# EAGLE design main (EAGLE 9.6.2)
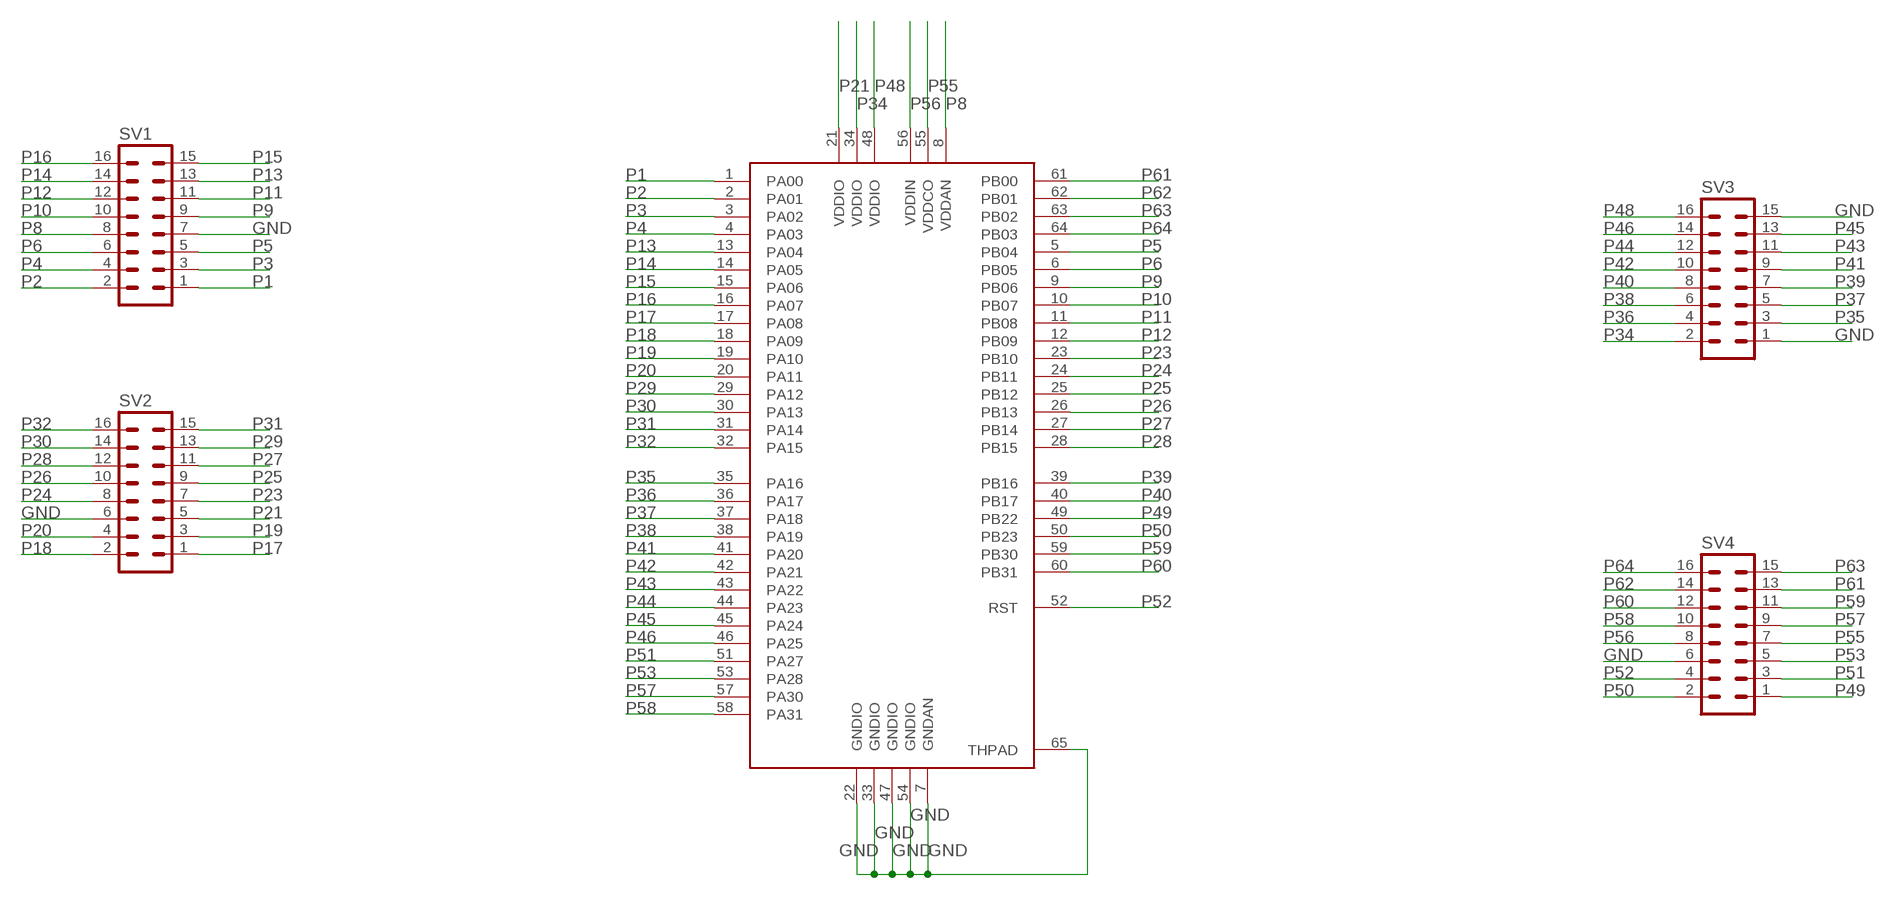
[diagram p0: schematic, sheet 1]

## Parts
SV1  MA08-2  [MA08-2]
SV2  MA08-2  [MA08-2]
SV3  MA08-2  [MA08-2]
SV4  MA08-2  [MA08-2]
U$1  ATSAMD21J18AQFN64  [QFN50P900X900X100-65T535]

## Nets
GND: SV1.7 SV2.6 SV3.1 SV3.15 SV4.6 U$1.7(GNDAN) U$1.22(GNDIO) U$1.33(GNDIO) U$1.47(GNDIO) U$1.54(GNDIO) U$1.65(THPAD)
P1: SV1.1 U$1.1(PA00)
P2: SV1.2 U$1.2(PA01)
P3: SV1.3 U$1.3(PA02)
P4: SV1.4 U$1.4(PA03)
P5: SV1.5 U$1.5(PB04)
P6: SV1.6 U$1.6(PB05)
P8: SV1.8 U$1.8(VDDAN)
P9: SV1.9 U$1.9(PB06)
P10: SV1.10 U$1.10(PB07)
P11: SV1.11 U$1.11(PB08)
P12: SV1.12 U$1.12(PB09)
P13: SV1.13 U$1.13(PA04)
P14: SV1.14 U$1.14(PA05)
P15: SV1.15 U$1.15(PA06)
P16: SV1.16 U$1.16(PA07)
P17: SV2.1 U$1.17(PA08)
P18: SV2.2 U$1.18(PA09)
P19: SV2.3 U$1.19(PA10)
P20: SV2.4 U$1.20(PA11)
P21: SV2.5 U$1.21(VDDIO)
P23: SV2.7 U$1.23(PB10)
P24: SV2.8 U$1.24(PB11)
P25: SV2.9 U$1.25(PB12)
P26: SV2.10 U$1.26(PB13)
P27: SV2.11 U$1.27(PB14)
P28: SV2.12 U$1.28(PB15)
P29: SV2.13 U$1.29(PA12)
P30: SV2.14 U$1.30(PA13)
P31: SV2.15 U$1.31(PA14)
P32: SV2.16 U$1.32(PA15)
P34: SV3.2 U$1.34(VDDIO)
P35: SV3.3 U$1.35(PA16)
P36: SV3.4 U$1.36(PA17)
P37: SV3.5 U$1.37(PA18)
P38: SV3.6 U$1.38(PA19)
P39: SV3.7 U$1.39(PB16)
P40: SV3.8 U$1.40(PB17)
P41: SV3.9 U$1.41(PA20)
P42: SV3.10 U$1.42(PA21)
P43: SV3.11 U$1.43(PA22)
P44: SV3.12 U$1.44(PA23)
P45: SV3.13 U$1.45(PA24)
P46: SV3.14 U$1.46(PA25)
P48: SV3.16 U$1.48(VDDIO)
P49: SV4.1 U$1.49(PB22)
P50: SV4.2 U$1.50(PB23)
P51: SV4.3 U$1.51(PA27)
P52: SV4.4 U$1.52(RST)
P53: SV4.5 U$1.53(PA28)
P55: SV4.7 U$1.55(VDDCO)
P56: SV4.8 U$1.56(VDDIN)
P57: SV4.9 U$1.57(PA30)
P58: SV4.10 U$1.58(PA31)
P59: SV4.11 U$1.59(PB30)
P60: SV4.12 U$1.60(PB31)
P61: SV4.13 U$1.61(PB00)
P62: SV4.14 U$1.62(PB01)
P63: SV4.15 U$1.63(PB02)
P64: SV4.16 U$1.64(PB03)

## Library data of the parts
SV1-SV4 = con-lstb_custom2:MA08-2: PIN HEADER; OC_FARNELL: unknown; OC_NEWARK: unknown
U$1 = atsamd21j18a:ATSAMD21J18A

## Board
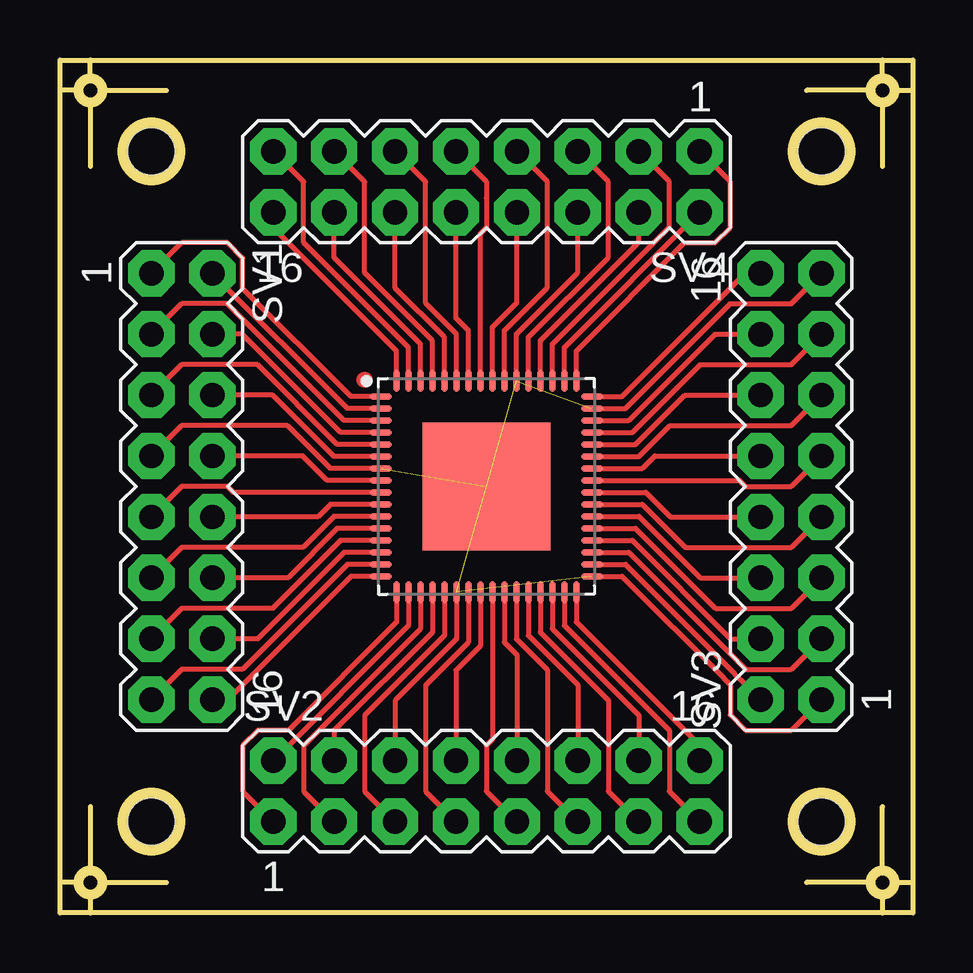
[diagram p1: board, top side]

Size 35.56 x 35.56 mm. Coordinates in mm from the lower left corner, seen from the top.
Outline: 34.29,35.56 0,35.56 0,1.27
Outline: 34.29,35.56 35.56,35.56 35.56,34.29
Outline: 35.56,34.29 35.56,1.27
Outline: 35.56,1.27 35.56,0 34.29,0
Outline: 34.29,0 1.27,0
Outline: 1.27,0 0,0 0,1.27
Outline: 1.91,1.27 4.45,1.27
Outline: 1.27,4.45 1.27,1.91
Outline: 0.64,1.27 0,1.27
Outline: 1.27,0.64 1.27,0
Outline: 34.29,0.64 34.29,0
Outline: 34.92,1.27 35.56,1.27
Outline: 34.29,1.91 34.29,4.45
Outline: 33.66,1.27 31.11,1.27
Outline: 34.92,34.29 35.56,34.29
Outline: 34.29,34.92 34.29,35.56
Outline: 33.66,34.29 31.11,34.29
Outline: 34.29,33.66 34.29,31.11
Outline: 1.27,34.92 1.27,35.56
Outline: 0.64,34.29 0,34.29
Outline: 1.91,34.29 4.45,34.29
Outline: 1.27,33.66 1.27,31.11
Outline: circle at 34.29,34.29 radius 0.5
Outline: circle at 1.27,34.29 radius 0.5
Outline: circle at 1.27,1.27 radius 0.5
Outline: circle at 34.29,1.27 radius 0.5
Outline: circle at 3.81,31.75 radius 1.2
Outline: circle at 31.75,31.75 radius 1.2
Outline: circle at 3.81,3.81 radius 1.2
Outline: circle at 31.75,3.81 radius 1.2
Copper layers (1*16): Top 0.035mm / dielectric 1.5mm / Bottom 0.035mm
Design rules "default *": minimum track width 6mil, minimum drill 0.35mm, track to track 0.25mm, track to pad 8mil, pad to pad 8mil, via to via 8mil, smd to smd 8mil, copper to edge 40mil, drill to drill 6mil, minimum pad ring 10mil, minimum via ring 8mil, stop-mask expansion 4mil, vias tented up to drill 0mil, thermal gap 10mil
Holes 2 mm at 3.81,31.75 31.75,31.75 3.81,3.81 31.75,3.81

### Footprints (pad centres in the part's own frame; a part is rotated, then mirrored left to right if it is on the bottom)
MA08-2 = drill 1.016 pad 1.93 octagon: 1 -8.89,-1.27; 2 -8.89,1.27; 3 -6.35,-1.27; 4 -6.35,1.27; 5 -3.81,-1.27; 6 -3.81,1.27; 7 -1.27,-1.27; 8 -1.27,1.27; 9 1.27,-1.27; 10 1.27,1.27; 11 3.81,-1.27; 12 3.81,1.27; 13 6.35,-1.27; 14 6.35,1.27; 15 8.89,-1.27; 16 8.89,1.27
QFN50P900X900X100-65T535 = smd 0.911 x 0.264: 1 -4.401,3.75; 2 -4.401,3.25; 3 -4.401,2.75; 4 -4.401,2.25; 5 -4.401,1.75; 6 -4.401,1.25; 7 -4.401,0.75; 8 -4.401,0.25; 9 -4.401,-0.25; 10 -4.401,-0.75; 11 -4.401,-1.25; 12 -4.401,-1.75; 13 -4.401,-2.25; 14 -4.401,-2.75; 15 -4.401,-3.25; 16 -4.401,-3.75; 33 4.401,-3.75; 34 4.401,-3.25; 35 4.401,-2.75; 36 4.401,-2.25; 37 4.401,-1.75; 38 4.401,-1.25; 39 4.401,-0.75; 40 4.401,-0.25; 41 4.401,0.25; 42 4.401,0.75; 43 4.401,1.25; 44 4.401,1.75; 45 4.401,2.25; 46 4.401,2.75; 47 4.401,3.25; 48 4.401,3.75 | smd 0.264 x 0.911: 17 -3.75,-4.401; 18 -3.25,-4.401; 19 -2.75,-4.401; 20 -2.25,-4.401; 21 -1.75,-4.401; 22 -1.25,-4.401; 23 -0.75,-4.401; 24 -0.25,-4.401; 25 0.25,-4.401; 26 0.75,-4.401; 27 1.25,-4.401; 28 1.75,-4.401; 29 2.25,-4.401; 30 2.75,-4.401; 31 3.25,-4.401; 32 3.75,-4.401; 49 3.75,4.401; 50 3.25,4.401; 51 2.75,4.401; 52 2.25,4.401; 53 1.75,4.401; 54 1.25,4.401; 55 0.75,4.401; 56 0.25,4.401; 57 -0.25,4.401; 58 -0.75,4.401; 59 -1.25,4.401; 60 -1.75,4.401; 61 -2.25,4.401; 62 -2.75,4.401; 63 -3.25,4.401; 64 -3.75,4.401 | smd 5.35 x 5.35: 65 0,0

### Placement (x,y rotation side)
SV1  5.08,17.78 270 top
SV2  17.78,5.08 0 top
SV3  30.48,17.78 90 top
SV4  17.78,30.48 180 top
U$1  17.78,17.78 0 top

### Tracks (layer width: path | path; a pad name or v marks a point on that pad's centre or on a via)
GND  (5 unrouted)
  Top 0.203: U$1.54 19.03,24.14 21.59,26.7 SV4.6 | U$1.47 23.58,21.03 27.95,25.4 30.48,25.4 SV3.15 | U$1.33 23.43,14.03 27.67,9.8 27.67,9.79 27.94,9.51 27.94,8.26 28.57,7.62 30.48,7.62 SV3.1 | U$1.22 16.53,11.42 13.97,8.86 SV2.6 | U$1.7 11.28,18.53 9.49,20.32 5.08,20.32 SV1.7
P1
  Top 0.203: U$1.1 12.12,21.53 7.62,26.04 7.62,27.3 6.99,27.94 5.08,27.94 SV1.1
P2
  Top 0.203: U$1.2 11.98,21.03 SV1.2
P3
  Top 0.203: U$1.3 11.84,20.53 6.97,25.4 5.08,25.4 SV1.3
P4
  Top 0.203: U$1.4 11.7,20.03 7.6,24.13 SV1.4
P5
  Top 0.203: U$1.5 11.56,19.53 8.23,22.86 5.08,22.86 SV1.5
P6
  Top 0.203: U$1.6 11.42,19.03 8.86,21.59 SV1.6
P8
  Top 0.203: U$1.8 11.14,18.03 10.12,19.05 SV1.8
P9
  Top 0.203: U$1.9 7.24,17.53 6.99,17.78 5.08,17.78 SV1.9
P10
  Top 0.203: SV1.10 10.76,16.51 11.28,17.03 U$1.10
P11
  Top 0.203: SV1.11 5.08,15.24 10.13,15.24 11.42,16.53 U$1.11
P12
  Top 0.203: U$1.12 11.56,16.03 9.5,13.97 SV1.12
P13
  Top 0.203: U$1.13 11.7,15.53 8.87,12.7 5.08,12.7 SV1.13
P14
  Top 0.203: U$1.14 11.84,15.03 8.24,11.43 SV1.14
P15
  Top 0.203: U$1.15 11.98,14.53 7.61,10.16 5.08,10.16 SV1.15
P16
  Top 0.203: U$1.16 12.12,14.03 6.99,8.89 SV1.16
P17
  Top 0.203: U$1.17 14.03,12.12 9.53,7.62 8.26,7.62 7.62,6.99 7.62,5.08 SV2.1
P18
  Top 0.203: U$1.18 14.53,11.98 SV2.2
P19
  Top 0.203: U$1.19 15.03,11.84 10.16,6.97 10.16,5.08 SV2.3
P20
  Top 0.203: U$1.20 15.53,11.7 11.43,7.6 SV2.4
P21
  Top 0.203: U$1.21 16.03,11.56 12.7,8.23 12.7,5.08 SV2.5
P23
  Top 0.203: U$1.23 17.03,11.28 15.24,9.49 15.24,5.08 SV2.7
P24
  Top 0.203: U$1.24 17.53,11.14 16.51,10.12 SV2.8
P25
  Top 0.203: SV2.9 17.78,5.08 17.78,6.99 18.03,7.24 U$1.25
P26
  Top 0.203: U$1.26 18.53,11.28 19.05,10.76 SV2.10
P27
  Top 0.203: U$1.27 19.03,11.42 20.32,10.13 20.32,5.08 SV2.11
P28
  Top 0.203: U$1.28 19.53,11.56 21.59,9.5 SV2.12
P29
  Top 0.203: U$1.29 20.03,11.7 22.86,8.87 22.86,5.08 SV2.13
P30
  Top 0.203: U$1.30 20.53,11.84 24.13,8.24 SV2.14
P31
  Top 0.203: U$1.31 21.03,11.98 25.4,7.61 25.4,5.08 SV2.15
P32
  Top 0.203: U$1.32 21.53,12.12 26.67,6.99 SV2.16
P34
  Top 0.203: U$1.34 23.58,14.53 28.12,9.98 28.12,9.97 28.39,9.71 SV3.2
P35
  Top 0.203: U$1.35 23.72,15.03 28.57,10.17 28.57,10.16 30.48,10.16 SV3.3
P36
  Top 0.203: U$1.36 23.86,15.53 27.96,11.43 SV3.4
P37
  Top 0.203: U$1.37 24,16.03 27.33,12.7 30.48,12.7 SV3.5
P38
  Top 0.203: U$1.38 24.14,16.53 26.7,13.97 SV3.6
P39
  Top 0.203: U$1.39 24.28,17.03 26.07,15.24 30.48,15.24 SV3.7
P40
  Top 0.203: U$1.40 24.42,17.53 25.44,16.51 SV3.8
P41
  Top 0.203: U$1.41 28.32,18.03 28.57,17.78 30.48,17.78 SV3.9
P42
  Top 0.203: U$1.42 24.28,18.53 24.8,19.05 SV3.10
P43
  Top 0.203: U$1.43 24.14,19.03 25.43,20.32 30.48,20.32 SV3.11
P44
  Top 0.203: U$1.44 24,19.53 26.06,21.59 SV3.12
P45
  Top 0.203: U$1.45 23.86,20.03 26.69,22.86 30.48,22.86 SV3.13
P46
  Top 0.203: U$1.46 23.72,20.53 27.32,24.13 SV3.14
P48
  Top 0.203: U$1.48 23.43,21.53 28.57,26.67 SV3.16
P49
  Top 0.203: U$1.49 21.53,23.43 26.04,27.94 27.3,27.94 27.94,28.57 27.94,30.48 SV4.1
P50
  Top 0.203: U$1.50 21.03,23.58 SV4.2
P51
  Top 0.203: U$1.51 20.53,23.72 25.4,28.59 25.4,30.48 SV4.3
P52
  Top 0.203: U$1.52 20.03,23.86 24.13,27.96 SV4.4
P53
  Top 0.203: U$1.53 19.53,24 22.86,27.33 22.86,30.48 SV4.5
P55
  Top 0.203: U$1.55 18.53,24.28 20.32,26.07 20.32,30.48 SV4.7
P56
  Top 0.203: U$1.56 18.03,24.42 19.05,25.44 SV4.8
P57
  Top 0.203: U$1.57 17.53,28.32 17.78,28.58 17.78,29.8 17.8,29.82 17.8,30.46 SV4.9
P58
  Top 0.203: U$1.58 17.03,24.28 16.51,24.8 SV4.10
P59
  Top 0.203: U$1.59 16.53,24.14 15.24,25.43 15.24,30.48 SV4.11
P60
  Top 0.203: U$1.60 16.03,24 13.97,26.06 SV4.12
P61
  Top 0.203: U$1.61 15.53,23.86 12.7,26.69 12.7,30.48 SV4.13
P62
  Top 0.203: U$1.62 15.03,23.72 11.43,27.32 SV4.14
P63
  Top 0.203: U$1.63 14.53,23.58 10.16,27.95 10.16,30.48 SV4.15
P64
  Top 0.203: U$1.64 14.03,23.43 8.89,28.57 SV4.16
(copper drawn outside any net)
  shapes: Top circle x1